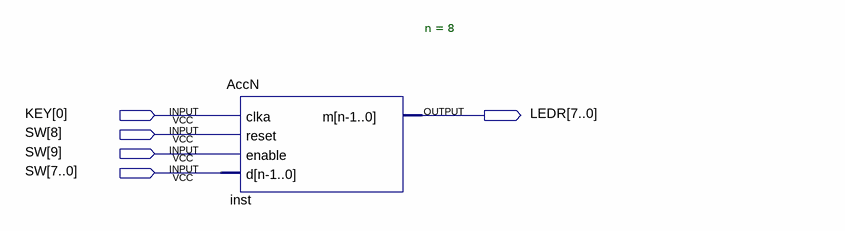
[diagram p0: schematic sheet]
// Quartus schematic AccN_Demo.bdf as structural Verilog: 1 symbols, 5 pins
module AccN_Demo (
  input  [0:0] KEY,
  input  [9:0] SW,
  output [7:0] LEDR
);

  AccN #(.n(8)) inst (.clka(KEY[0]), .reset(SW[8]), .enable(SW[9]), .d(SW[7:0]), .m(LEDR));
endmodule
